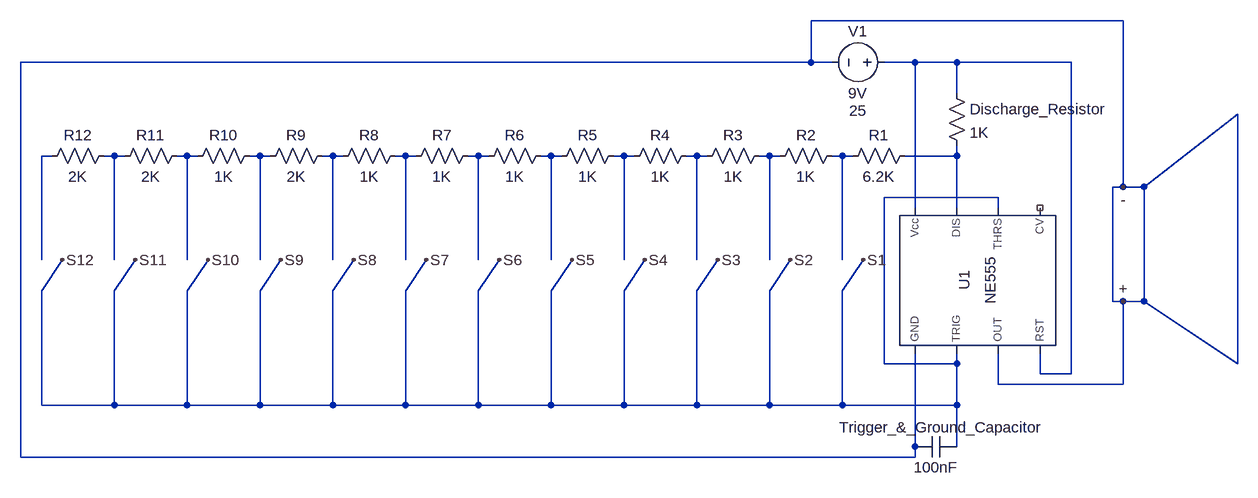
[diagram p0: schematic Schema.asc]
Schema.asc, the LTspice schematic file:
Version 4
SHEET 1 1252 740
WIRE 1072 -32 592 -32
WIRE 592 32 592 -32
WIRE 592 32 -624 32
WIRE 624 32 592 32
WIRE 752 32 704 32
WIRE 816 32 752 32
WIRE 992 32 816 32
WIRE 816 80 816 32
WIRE -576 176 -592 176
WIRE -480 176 -496 176
WIRE -464 176 -480 176
WIRE -368 176 -384 176
WIRE -352 176 -368 176
WIRE -256 176 -272 176
WIRE -240 176 -256 176
WIRE -144 176 -160 176
WIRE -128 176 -144 176
WIRE -32 176 -48 176
WIRE -16 176 -32 176
WIRE 80 176 64 176
WIRE 96 176 80 176
WIRE 192 176 176 176
WIRE 208 176 192 176
WIRE 304 176 288 176
WIRE 320 176 304 176
WIRE 416 176 400 176
WIRE 432 176 416 176
WIRE 528 176 512 176
WIRE 544 176 528 176
WIRE 640 176 624 176
WIRE 656 176 640 176
WIRE 816 176 816 160
WIRE 816 176 736 176
WIRE 1072 224 1072 -32
WIRE 1072 224 1056 224
WIRE 1104 224 1248 112
WIRE 1104 224 1072 224
WIRE 880 240 704 240
WIRE 752 256 752 32
WIRE 816 256 816 176
WIRE 880 256 880 240
WIRE -592 336 -592 176
WIRE -480 336 -480 176
WIRE -368 336 -368 176
WIRE -256 336 -256 176
WIRE -144 336 -144 176
WIRE -32 336 -32 176
WIRE 80 336 80 176
WIRE 192 336 192 176
WIRE 304 336 304 176
WIRE 416 336 416 176
WIRE 528 336 528 176
WIRE 640 336 640 176
WIRE -592 384 -560 336
WIRE -480 384 -448 336
WIRE -368 384 -336 336
WIRE -256 384 -224 336
WIRE -144 384 -112 336
WIRE -32 384 0 336
WIRE 80 384 112 336
WIRE 192 384 224 336
WIRE 304 384 336 336
WIRE 416 384 448 336
WIRE 528 384 560 336
WIRE 640 384 672 336
WIRE 1056 400 1056 224
WIRE 1072 400 1056 400
WIRE 1104 400 1104 224
WIRE 1104 400 1072 400
WIRE 704 496 704 240
WIRE 816 496 816 480
WIRE 816 496 704 496
WIRE 1248 496 1248 112
WIRE 1248 496 1104 400
WIRE 944 512 944 480
WIRE 992 512 992 32
WIRE 992 512 944 512
WIRE 880 528 880 480
WIRE 1072 528 1072 400
WIRE 1072 528 880 528
WIRE -592 560 -592 384
WIRE -480 560 -480 384
WIRE -480 560 -592 560
WIRE -368 560 -368 384
WIRE -368 560 -480 560
WIRE -256 560 -256 384
WIRE -256 560 -368 560
WIRE -144 560 -144 384
WIRE -144 560 -256 560
WIRE -32 560 -32 384
WIRE -32 560 -144 560
WIRE 80 560 80 384
WIRE 80 560 -32 560
WIRE 192 560 192 384
WIRE 192 560 80 560
WIRE 304 560 304 384
WIRE 304 560 192 560
WIRE 416 560 416 384
WIRE 416 560 304 560
WIRE 528 560 528 384
WIRE 528 560 416 560
WIRE 640 560 640 384
WIRE 640 560 528 560
WIRE 816 560 816 496
WIRE 816 560 640 560
WIRE 752 624 752 480
WIRE 816 624 816 560
WIRE -624 640 -624 32
WIRE 752 640 752 624
WIRE 752 640 -624 640
FLAG 672 336 S1
FLAG 560 336 S2
FLAG 448 336 S3
FLAG 336 336 S4
FLAG 224 336 S5
FLAG 112 336 S6
FLAG 0 336 S7
FLAG -112 336 S8
FLAG -224 336 S9
FLAG -336 336 S10
FLAG -448 336 S11
FLAG -560 336 S12
FLAG 1072 400 +
FLAG 1072 224 -
SYMBOL voltage 720 32 R90
WINDOW 0 -32 56 VBottom 2
WINDOW 3 32 56 VTop 2
WINDOW 123 0 0 Left 0
WINDOW 39 74 56 VCenter 2
SYMATTR InstName V1
SYMATTR Value 9V
SYMATTR SpiceLine 25
SYMBOL res 800 64 R0
SYMATTR InstName Discharge_Resistor
SYMATTR Value 1K
SYMBOL Misc\\NE555 848 368 R270
SYMATTR InstName U1
SYMBOL cap 816 608 R90
WINDOW 0 -14 -137 VRight 2
WINDOW 3 32 32 VTop 2
SYMATTR InstName Trigger_&_Ground_Capacitor
SYMATTR Value 100nF
SYMBOL res 752 160 R90
WINDOW 0 0 56 VBottom 2
WINDOW 3 32 56 VTop 2
SYMATTR InstName R1
SYMATTR Value 6.2K
SYMBOL res 640 160 R90
WINDOW 0 0 56 VBottom 2
WINDOW 3 32 56 VTop 2
SYMATTR InstName R2
SYMATTR Value 1K
SYMBOL res 528 160 R90
WINDOW 0 0 56 VBottom 2
WINDOW 3 32 56 VTop 2
SYMATTR InstName R3
SYMATTR Value 1K
SYMBOL res 416 160 R90
WINDOW 0 0 56 VBottom 2
WINDOW 3 32 56 VTop 2
SYMATTR InstName R4
SYMATTR Value 1K
SYMBOL res 304 160 R90
WINDOW 0 0 56 VBottom 2
WINDOW 3 32 56 VTop 2
SYMATTR InstName R5
SYMATTR Value 1K
SYMBOL res 192 160 R90
WINDOW 0 0 56 VBottom 2
WINDOW 3 32 56 VTop 2
SYMATTR InstName R6
SYMATTR Value 1K
SYMBOL res 80 160 R90
WINDOW 0 0 56 VBottom 2
WINDOW 3 32 56 VTop 2
SYMATTR InstName R7
SYMATTR Value 1K
SYMBOL res -32 160 R90
WINDOW 0 0 56 VBottom 2
WINDOW 3 32 56 VTop 2
SYMATTR InstName R8
SYMATTR Value 1K
SYMBOL res -144 160 R90
WINDOW 0 0 56 VBottom 2
WINDOW 3 32 56 VTop 2
SYMATTR InstName R9
SYMATTR Value 2K
SYMBOL res -256 160 R90
WINDOW 0 0 56 VBottom 2
WINDOW 3 32 56 VTop 2
SYMATTR InstName R10
SYMATTR Value 1K
SYMBOL res -368 160 R90
WINDOW 0 0 56 VBottom 2
WINDOW 3 32 56 VTop 2
SYMATTR InstName R11
SYMATTR Value 2K
SYMBOL res -480 160 R90
WINDOW 0 0 56 VBottom 2
WINDOW 3 32 56 VTop 2
SYMATTR InstName R12
SYMATTR Value 2K

The netlist it stands for:
* Schema.asc
V1 N001 - 9V 25
R§Discharge_Resistor N001 N014 1K
XU1 - S12 - N001 NC_01 S12 N014 N001 NE555  ; pins GND TRIG OUT RST CV THRS DIS Vcc
C§Trigger_&_Ground_Capacitor S12 - 100nF
R1 N014 N013 6.2K
R2 N013 N012 1K
R3 N012 N011 1K
R4 N011 N010 1K
R5 N010 N009 1K
R6 N009 N008 1K
R7 N008 N007 1K
R8 N007 N006 1K
R9 N006 N005 2K
R10 N005 N004 1K
R11 N004 N003 2K
R12 N003 N002 2K
.lib NE555.sub
.backanno
.end